# EAGLE schematic uControllerJackInterface (EAGLE 9.6.0)
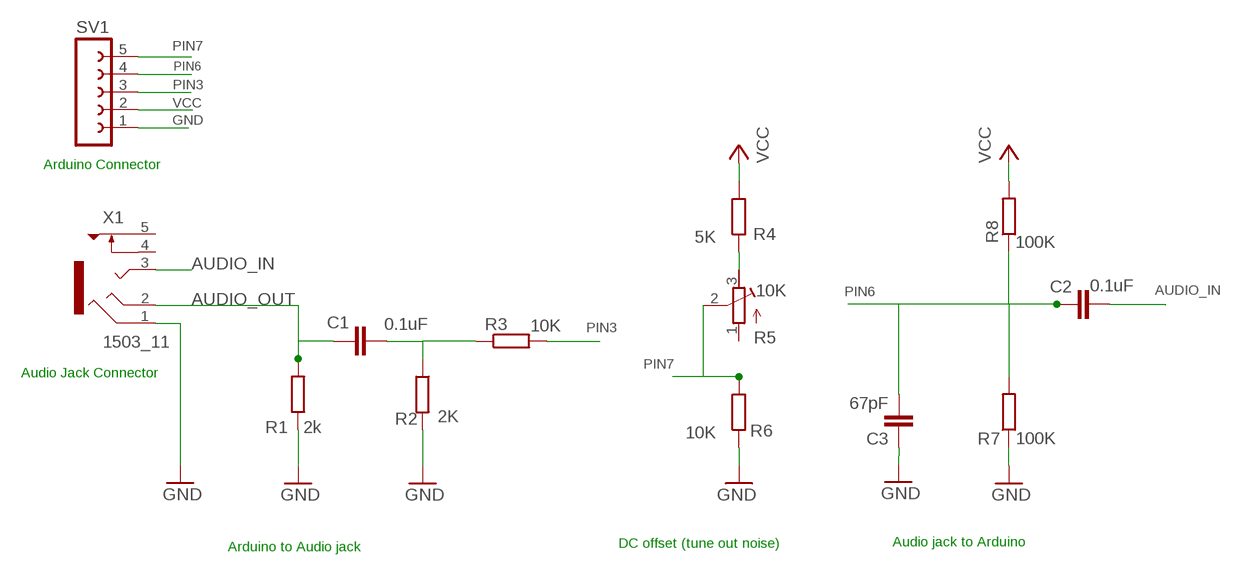
[diagram p0: schematic, sheet 1]

## Parts
C1  0.1uF  C-EU025-025X050  [C025-025X050]
C2  0.1uF  C-EU025-025X050  [C025-025X050]
C3  67pF  C-EU025-025X050  [C025-025X050]
R1  2k  R-EU_0204/7  [0204/7]
R2  2K  R-EU_0204/7  [0204/7]
R3  10K  R-EU_0204/7  [0204/7]
R4  5K  R-EU_0204/7  [0204/7]
R5  10K  R-TRIMM64Y  [RTRIM64Y]
R6  10K  R-EU_0204/7  [0204/7]
R7  100K  R-EU_0204/7  [0204/7]
R8  100K  R-EU_0204/7  [0204/7]
SV1  FE05-1  [FE05-1]
X1  1503_11  [1503_11]

## Nets
AUDIO_IN: C2.2 X1.3
AUDIO_OUT: C1.1 R1.2 X1.2
GND: C3.1 R1.1 R2.2 R6.1 R7.1 SV1.1 X1.1
N$1: C1.2 R2.1 R3.1
N$3: R4.1 R5.3(E)
PIN3: R3.2 SV1.3
PIN6: C2.1 C3.2 R7.2 R8.1 SV1.4
PIN7: R5.2(S) R6.2 SV1.5
VCC: R4.2 R8.2 SV1.2
Unconnected: R5.1(A) X1.4 X1.5

## Notes on the sheet
- Arduino Connector
- Audio Jack Connector
- DC offset (tune out noise) | Audio jack to Arduino
- Arduino to Audio jack

## Library data of the parts
C1-C3 = rcl:C-EU: CAPACITOR, European symbol; SPICEPREFIX: C
R1-R4 R6-R8 = rcl:R-EU_: RESISTOR, European symbol; SPICEPREFIX: R
R5 = rcl:R-TRIMM: Trimm resistor; SPICEMODEL: X; SPICEPREFIXL: POT
SV1 = con-lsta:FE05-1: FEMALE HEADER; OC_FARNELL: unknown; OC_NEWARK: unknown
X1 = con-lumberg:1503_11: Jack connectors according to JISC 6560, 3.5 mm Klinkeneinbaukupplung nach JISC 6560, 3,5 mm, 3-polig/ stereo, stehende Ausführung, mit Öffner, für Leiterplatten Source: http://www.lumberg.com/Produkte/PDFs/1503_11.pdf; OC_FARNELL: 1308869; OC_NEWARK: unknown